# Altium schematic sheet Negative_Schematic.SchDoc
size A4; SheetNumber: 1; SheetTotal: 1
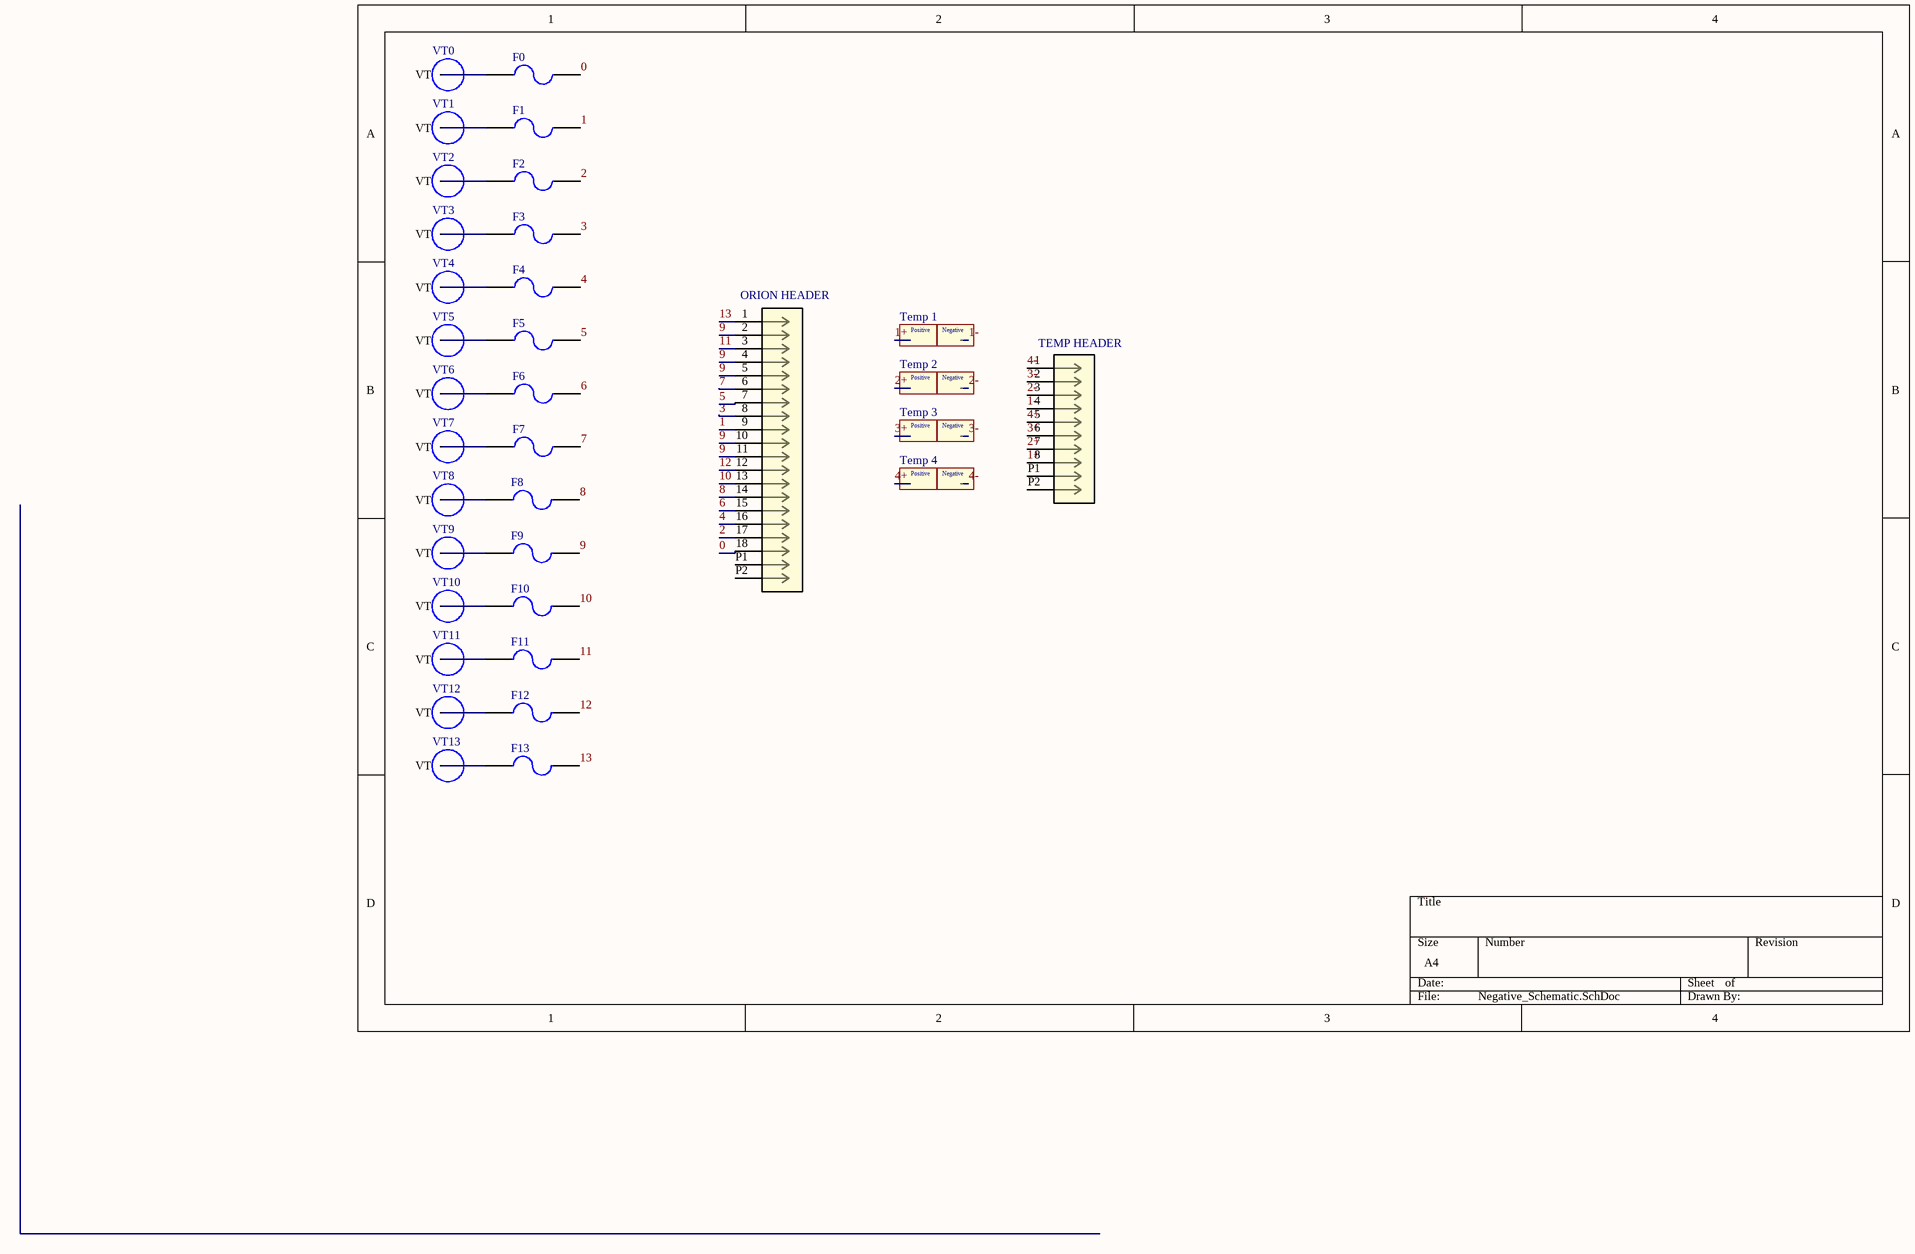
[diagram p0: Negative_Schematic.SchDoc]

## Parts
F0  0154.750MRL  [0451Series_LTF]  (value not drawn)
F1  0154.750MRL  [0451Series_LTF]  (value not drawn)
F2  0154.750MRL  [0451Series_LTF]  (value not drawn)
F3  0154.750MRL  [0451Series_LTF]  (value not drawn)
F4  0154.750MRL  [0451Series_LTF]  (value not drawn)
F5  0154.750MRL  [0451Series_LTF]  (value not drawn)
F6  0154.750MRL  [0451Series_LTF]  (value not drawn)
F7  0154.750MRL  [0451Series_LTF]  (value not drawn)
F8  0154.750MRL  [0451Series_LTF]  (value not drawn)
F9  0154.750MRL  [0451Series_LTF]  (value not drawn)
F10  0154.750MRL  [0451Series_LTF]  (value not drawn)
F11  0154.750MRL  [0451Series_LTF]  (value not drawn)
F12  0154.750MRL  [0451Series_LTF]  (value not drawn)
F13  0154.750MRL  [0451Series_LTF]  (value not drawn)
ORION_HEADER  430451815  [CON_430451815_MOL]  (value not drawn)
Temp_1  Temp_Pins  [TEMP_PINS]  (value not drawn)
Temp_2  temp 2  [TEMP_PINS]  (value not drawn)
Temp_3  Temp_Pins  [TEMP_PINS]  (value not drawn)
Temp_4  Temp_Pins  [TEMP_PINS]  (value not drawn)
TEMP_HEADER  430450815  [CON_430450815_MOL]  (value not drawn)
VT0  Voltage_Tap  [VOLTAGE_TAP]  (value not drawn)
VT1  Voltage_Tap  [VOLTAGE_TAP]  (value not drawn)
VT2  Voltage_Tap  [VOLTAGE_TAP]  (value not drawn)
VT3  Voltage_Tap  [VOLTAGE_TAP]  (value not drawn)
VT4  Voltage_Tap  [VOLTAGE_TAP]  (value not drawn)
VT5  Voltage_Tap  [VOLTAGE_TAP]  (value not drawn)
VT6  Voltage_Tap  [VOLTAGE_TAP]  (value not drawn)
VT7  Voltage_Tap  [VOLTAGE_TAP]  (value not drawn)
VT8  Voltage_Tap  [VOLTAGE_TAP]  (value not drawn)
VT9  Voltage_Tap  [VOLTAGE_TAP]  (value not drawn)
VT10  Voltage_Tap  [VOLTAGE_TAP]  (value not drawn)
VT11  Voltage_Tap  [VOLTAGE_TAP]  (value not drawn)
VT12  Voltage_Tap  [VOLTAGE_TAP]  (value not drawn)
VT13  Voltage_Tap  [VOLTAGE_TAP]  (value not drawn)

## Nets
0: F0.2 ORION_HEADER.18
1: F1.2 ORION_HEADER.9
1+: Temp_1.1+ TEMP_HEADER.8
1-: Temp_1.1- TEMP_HEADER.4
2: F2.2 ORION_HEADER.17
2+: Temp_2.1+ TEMP_HEADER.7
2-: Temp_2.1- TEMP_HEADER.3
3: F3.2 ORION_HEADER.8
3+: Temp_3.1+ TEMP_HEADER.6
3-: Temp_3.1- TEMP_HEADER.2
4: F4.2 ORION_HEADER.16
4+: Temp_4.1+ TEMP_HEADER.5
4-: Temp_4.1- TEMP_HEADER.1
5: F5.2 ORION_HEADER.7
6: F6.2 ORION_HEADER.15
7: F7.2 ORION_HEADER.6
8: F8.2 ORION_HEADER.14
9: F9.2 ORION_HEADER.2 ORION_HEADER.4 ORION_HEADER.5 ORION_HEADER.10 ORION_HEADER.11
10: F10.2 ORION_HEADER.13
11: F11.2 ORION_HEADER.3
12: F12.2 ORION_HEADER.12
13: F13.2 ORION_HEADER.1
NetF0_1: F0.1 VT0.1(VT)
NetF1_1: F1.1 VT1.1(VT)
NetF2_1: F2.1 VT2.1(VT)
NetF3_1: F3.1 VT3.1(VT)
NetF4_1: F4.1 VT4.1(VT)
NetF5_1: F5.1 VT5.1(VT)
NetF6_1: F6.1 VT6.1(VT)
NetF7_1: F7.1 VT7.1(VT)
NetF8_1: F8.1 VT8.1(VT)
NetF9_1: F9.1 VT9.1(VT)
NetF10_1: F10.1 VT10.1(VT)
NetF11_1: F11.1 VT11.1(VT)
NetF12_1: F12.1 VT12.1(VT)
NetF13_1: F13.1 VT13.1(VT)

Not connected (* = marked no-connect by the designer): ORION_HEADER P1 P2; TEMP_HEADER P1 P2

## Notes on the sheet
- (in symbol Temp_Pins) Positive; Negative

## Library data of the parts
F0-F13 = 0154.750MRL: FUSE BOARD MNT 750MA 125VAC/VDC; Manufacturer: Littelfuse Inc.; Part Number: 0154.750MRL; Digikey Part Number: F2576CT-ND; Digikey Link: https://www.digikey.com.au/en/products/detail/littelfuse-inc/0451-750MRL/700816
ORION_HEADER = 430451815: No Description Available; Mfr_Name: Molex Connector Corporation; RefDes: RefDes; Type: Type
Temp_2 = Temp_Pins
TEMP_HEADER = 430450815: No Description Available; Mfr_Name: Molex Connector Corporation; RefDes: RefDes; Type: Type
VT0-VT13 = Voltage Tap: Positions: 1; Pitch: 0mm; Angle: 0; Flange: No; Contact: NA; Part Number: Voltage Tap; Row Spacing: 0mm